# EAGLE design maho-encoder (EAGLE 4.16)
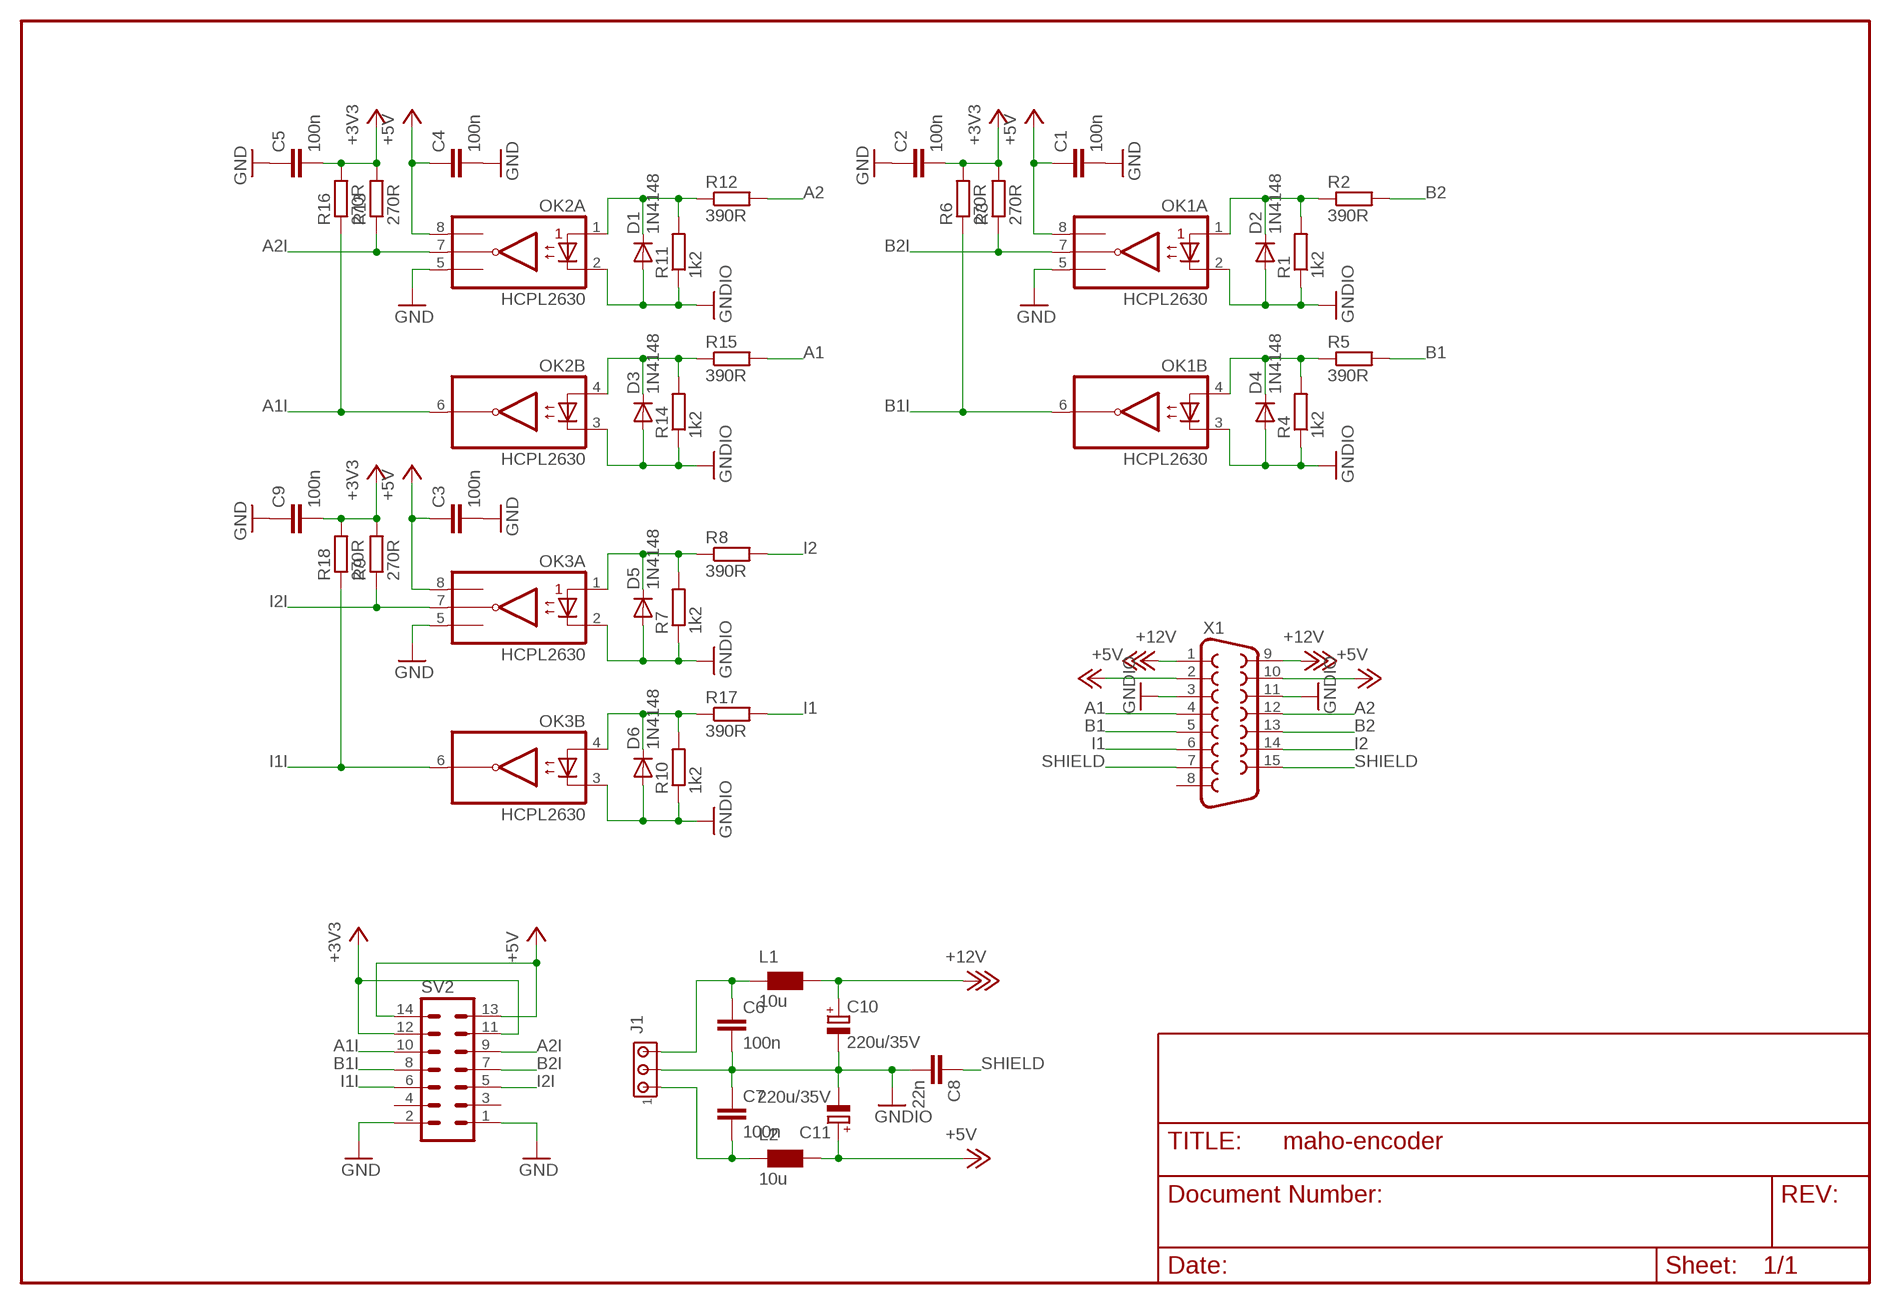
[diagram p0: schematic, sheet 1]

## Parts
C1  100n  C-EUC0603  [C0603]
C2  100n  C-EUC0603  [C0603]
C3  100n  C-EUC0603  [C0603]
C4  100n  C-EUC0603  [C0603]
C5  100n  C-EUC0603  [C0603]
C6  100n  C-EUC0603  [C0603]
C7  100n  C-EUC0603  [C0603]
C8  22n  C-EUC0603  [C0603]
C9  100n  C-EUC0603  [C0603]
C10  220u/35V  CPOL-EUF  [PANASONIC_F]
C11  220u/35V  CPOL-EUF  [PANASONIC_F]
D1  1N4148  DIODE-MINIMELF  [MINIMELF]
D2  1N4148  DIODE-MINIMELF  [MINIMELF]
D3  1N4148  DIODE-MINIMELF  [MINIMELF]
D4  1N4148  DIODE-MINIMELF  [MINIMELF]
D5  1N4148  DIODE-MINIMELF  [MINIMELF]
D6  1N4148  DIODE-MINIMELF  [MINIMELF]
J1  MTA03-100  [10X03MTA]
L1  10u  WE-HC_744312...  [WE-HC_744312...]
L2  10u  WE-HC_744312...  [WE-HC_744312...]
OK1  HCPL2630  [DIL08]
OK2  HCPL2630  [DIL08]
OK3  HCPL2630  [DIL08]
R1  1k2  R-EU_R0805  [R0805]
R2  390R  R-EU_R0805  [R0805]
R3  270R  R-EU_R0805  [R0805]
R4  1k2  R-EU_R0805  [R0805]
R5  390R  R-EU_R0805  [R0805]
R6  270R  R-EU_R0805  [R0805]
R7  1k2  R-EU_R0805  [R0805]
R8  390R  R-EU_R0805  [R0805]
R9  270R  R-EU_R0805  [R0805]
R10  1k2  R-EU_R0805  [R0805]
R11  1k2  R-EU_R0805  [R0805]
R12  390R  R-EU_R0805  [R0805]
R13  270R  R-EU_R0805  [R0805]
R14  1k2  R-EU_R0805  [R0805]
R15  390R  R-EU_R0805  [R0805]
R16  270R  R-EU_R0805  [R0805]
R17  390R  R-EU_R0805  [R0805]
R18  270R  R-EU_R0805  [R0805]
SV2  ML14  [ML14]
X1  F15HP  [F15HP]

## Nets
+3V3: C2.2 C5.2 C9.2 R3.2 R6.2 R9.2 R13.2 R16.2 R18.2 SV2.11 SV2.12
+5V: C1.1 C3.1 C4.1 OK1.8(A:VCC) OK2.8(A:VCC) OK3.8(A:VCC) SV2.13 SV2.14
+12V: C11.+ L2.2 X1.2 X1.10 ; supply symbol labelled +5V
+18V: C10.+ L1.2 X1.1 X1.9 ; supply symbol labelled +12V
A1: R15.2 X1.4
A1I: OK2.6(B:VO2) R16.1 SV2.10
A2: R12.2 X1.12
A2I: OK2.7(A:VO1) R13.1 SV2.9
B1: R5.2 X1.5
B1I: OK1.6(B:VO2) R6.1 SV2.8
B2: R2.2 X1.13
B2I: OK1.7(A:VO1) R3.1 SV2.7
GND: C1.2 C2.1 C3.2 C4.2 C5.1 C9.1 OK1.5(A:GND) OK2.5(A:GND) OK3.5(A:GND) SV2.1 SV2.2
GNDIO: C6.2 C7.1 C8.2 C10.- C11.- D1.A D2.A D3.A D4.A D5.A D6.A J1.2 OK1.2(A:C1) OK1.3(B:C2) OK2.2(A:C1) OK2.3(B:C2) OK3.2(A:C1) OK3.3(B:C2) R1.1 R4.1 R7.1 R10.1 R11.1 R14.1 X1.3 X1.11
I1: R17.2 X1.6
I1I: OK3.6(B:VO2) R18.1 SV2.6
I2: R8.2 X1.14
I2I: OK3.7(A:VO1) R9.1 SV2.5
N$1: D3.C OK2.4(B:A2) R14.2 R15.1
N$2: D1.C OK2.1(A:A1) R11.2 R12.1
N$3: D4.C OK1.4(B:A2) R4.2 R5.1
N$4: D2.C OK1.1(A:A1) R1.2 R2.1
N$5: D6.C OK3.4(B:A2) R10.2 R17.1
N$6: D5.C OK3.1(A:A1) R7.2 R8.1
N$7: C7.2 J1.1 L2.1
N$15: C6.1 J1.3 L1.1
SHIELD: C8.1 X1.7 X1.15
Unconnected: SV2.3 SV2.4 X1.8

## Library data of the parts
C1-C9 = rcl:C-EU: CAPACITOR, European symbol
C10 C11 = rcl:CPOL-EU: POLARIZED CAPACITOR, European symbol
D1-D6 = diode:DIODE-: DIODE
J1 = con-amp:MTA03-100: AMP connector
L1 L2 = wuerth-elektronik:WE-HC: SMD-Flat Wire Inductors WE-HC HIGH CURRENT Lower losses and no thermal aging because of the new advanced core material Superflux 200 - Flat wire coil for lower losses at high frequency ranges - Low leakage field - Extremely low profile design - Current loading up to 30 A -- Graphic cards -- Laptops -- Motherboards -- High current switching regulators -- Automotive electronics
OK1-OK3 = optocoupler:HCPL2630: HEWLETT PACKARD OPTO COUPLER
R1-R18 = rcl:R-EU_: RESISTOR, European symbol
SV2 = con-harting-ml:ML14: HARTING
X1 = con-subd:F15: SUB-D

## Board
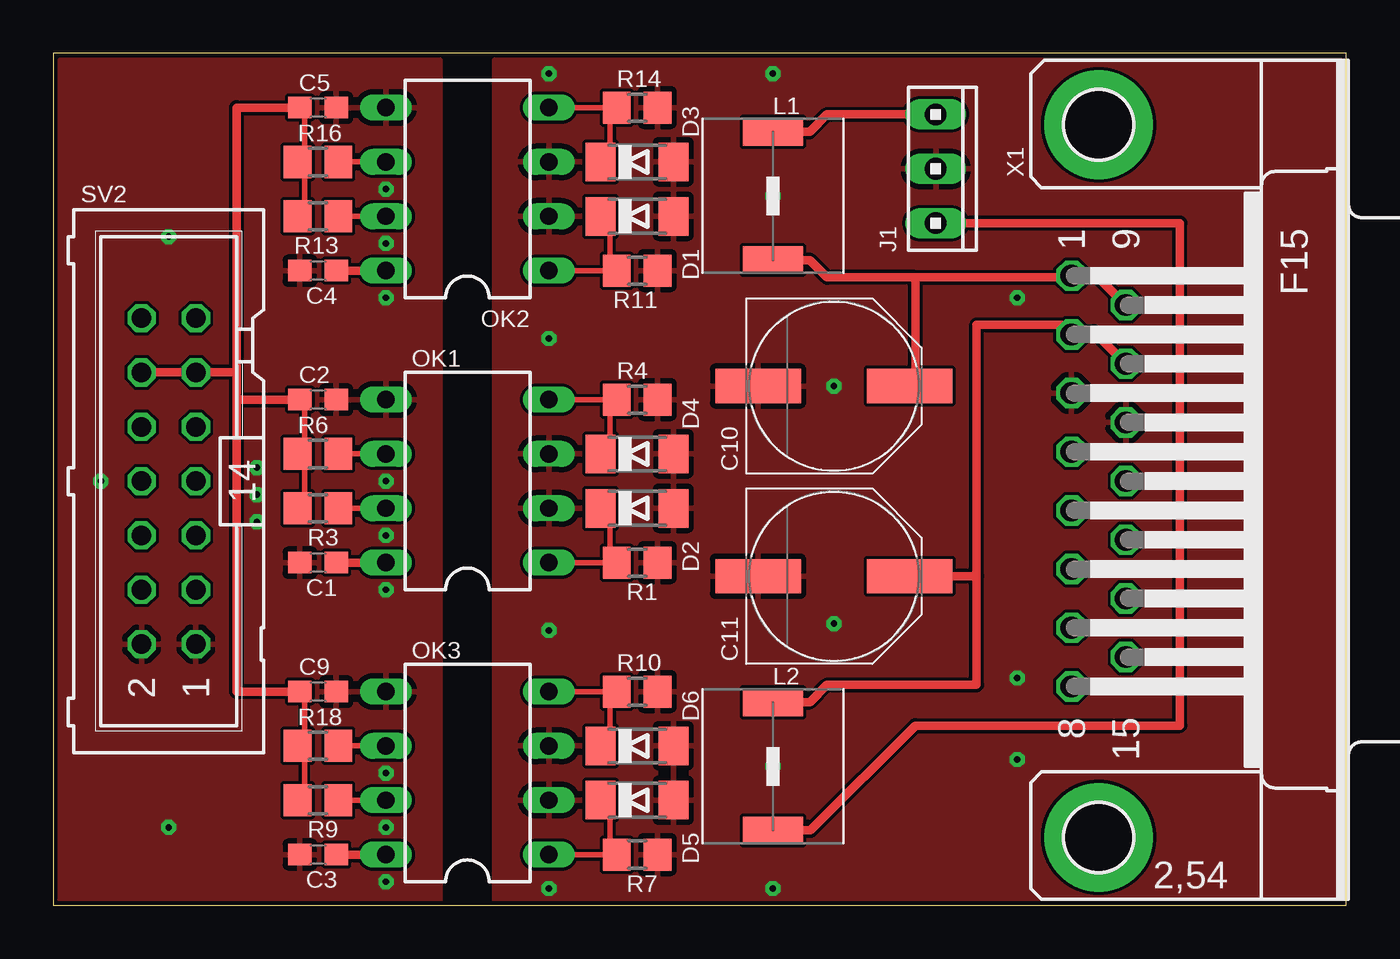
[diagram p1: board, top side]
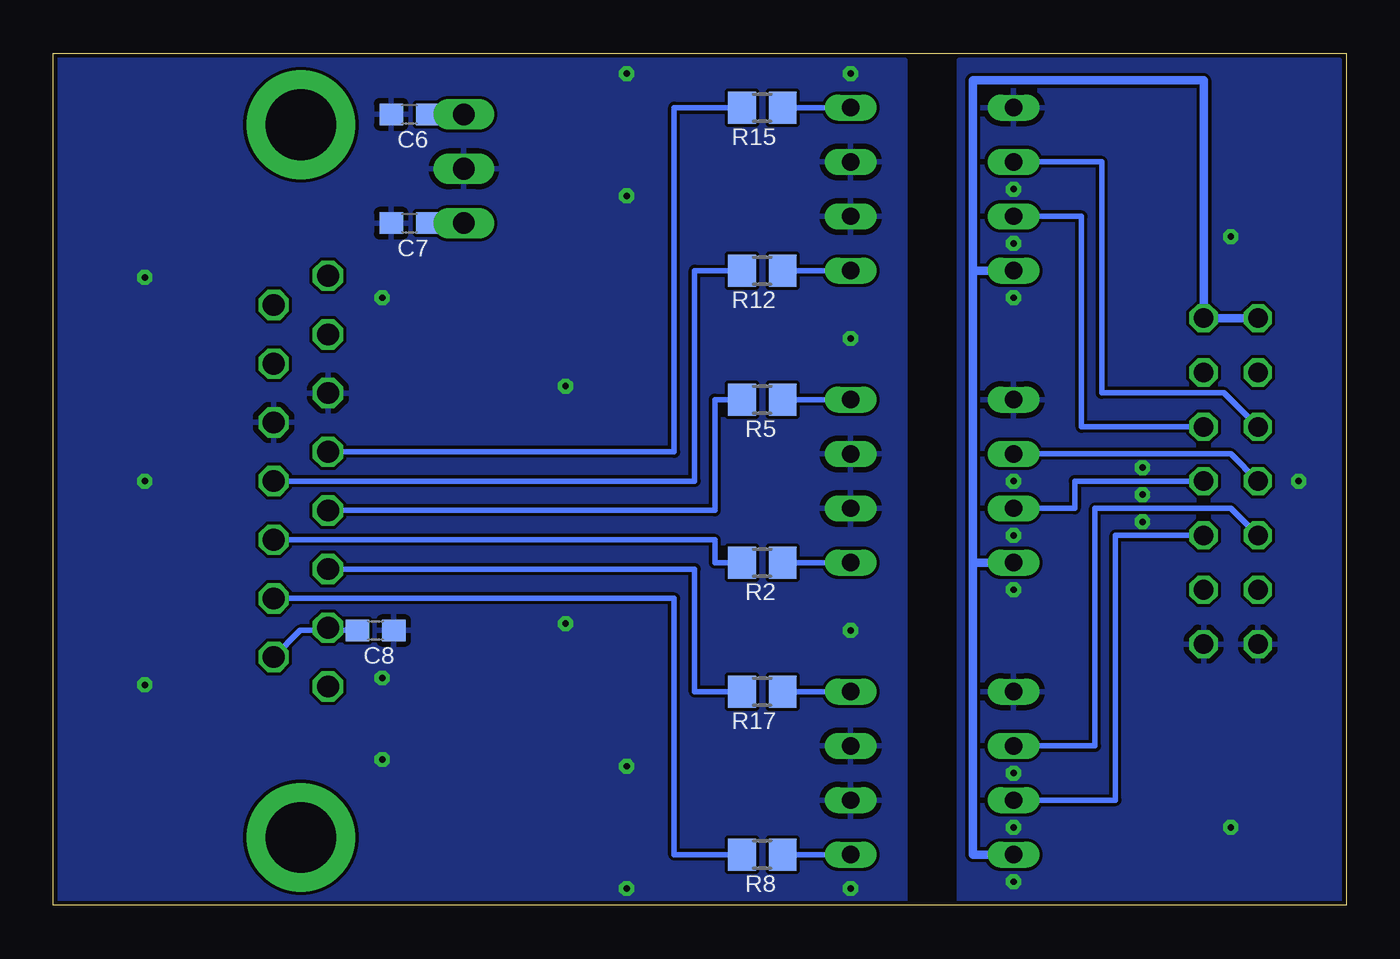
[diagram p2: board, bottom side, seen from below]

Size 60.46 x 39.83 mm. Coordinates in mm from the lower left corner, seen from the top.
Outline: 0,0 60.46,0 60.46,39.83 0,39.83 0,0
Copper layers (1+2*15+16): Top 0.035mm / dielectric 0.15mm / Route2 0.018mm / dielectric 1.5mm / Route15 0.018mm / dielectric 0.15mm / Bottom 0.035mm
Design rules "eurocircuits_class5": minimum track width 0.15mm, minimum drill 0.2mm, track to track 0.15mm, track to pad 0.15mm, pad to pad 0.15mm, via to via 0.15mm, smd to smd 0mil, copper to edge 0.2mm, drill to drill 0.2mm, minimum pad ring 0.2mm, minimum via ring 0.2mm, stop-mask expansion 4mil, vias tented up to drill 0mil, thermal gap 10mil

### Footprints (pad centres in the part's own frame; a part is rotated, then mirrored left to right if it is on the bottom)
C0603 = smd 1.1 x 1: 1 -0.85,0; 2 0.85,0
PANASONIC_F = smd 4 x 1.6: + 3.55,0; - -3.55,0
MINIMELF = smd 1.4 x 1.8: A 1.7,0; C -1.7,0
10X03MTA = drill 1.016 long: 1 2.54,0; 2 0,0; 3 -2.54,0
WE-HC_744312... = smd 1.3 x 2.8: 1 -3,0; 2 3,0
DIL08 = drill 0.813 long: 1 -3.81,-3.81; 2 -1.27,-3.81; 3 1.27,-3.81; 4 3.81,-3.81; 5 3.81,3.81; 6 1.27,3.81; 7 -1.27,3.81; 8 -3.81,3.81
R0805 = smd 1.3 x 1.5: 1 -0.95,0; 2 0.95,0
ML14 = drill 0.914 octagon: 1 -7.62,-1.27; 2 -7.62,1.27; 3 -5.08,-1.27; 4 -5.08,1.27; 5 -2.54,-1.27; 6 -2.54,1.27; 7 0,-1.27; 8 0,1.27; 9 2.54,-1.27; 10 2.54,1.27; 11 5.08,-1.27; 12 5.08,1.27; 13 7.62,-1.27; 14 7.62,1.27
F15HP = drill 1.016 octagon: 1 -9.601,-1.27; 2 -6.858,-1.27; 3 -4.115,-1.27; 4 -1.372,-1.27; 5 1.372,-1.27; 6 4.115,-1.27; 7 6.858,-1.27; 8 9.601,-1.27; 9 -8.23,1.27; 10 -5.486,1.27; 11 -2.743,1.27; 12 0,1.27; 13 2.743,1.27; 14 5.486,1.27; 15 8.23,1.27 | drill 3.302 pad 5.08 round: G1 -16.662,0; G2 16.662,0

### Placement (x,y rotation side)
C1  12.38,16.03 180 top
C2  12.38,23.65 180 top
C3  12.38,2.38 180 top
C4  12.38,29.68 180 top
C5  12.38,37.3 180 top
C6  43.81,36.98 180 bottom
C7  43.81,31.9 0 bottom
C8  45.4,12.85 0 bottom
C9  12.38,10 180 top
C10  36.51,24.28 0 top
C11  36.51,15.39 0 top
D1  27.3,32.22 0 top
D2  27.3,18.57 0 top
D3  27.3,34.76 0 top
D4  27.3,21.11 0 top
D5  27.3,4.92 0 top
D6  27.3,7.46 0 top
J1  41.27,34.44 270 top
L1  33.65,33.17 270 top
L2  33.65,6.5 90 top
OK1  19.36,19.84 90 top
OK2  19.36,33.49 90 top
OK3  19.36,6.18 90 top
R1  27.3,16.03 180 top
R2  27.3,16.03 180 bottom
R3  12.38,18.57 180 top
R4  27.3,23.65 180 top
R5  27.3,23.65 180 bottom
R6  12.38,21.11 180 top
R7  27.3,2.38 180 top
R8  27.3,2.38 180 bottom
R9  12.38,4.92 180 top
R10  27.3,10 180 top
R11  27.3,29.68 180 top
R12  27.3,29.68 180 bottom
R13  12.38,32.22 180 top
R14  27.3,37.3 180 top
R15  27.3,37.3 180 bottom
R16  12.38,34.76 180 top
R17  27.3,10 180 bottom
R18  12.38,7.46 180 top
SV2  5.39,19.84 90 top
X1  48.89,19.84 270 top

### Tracks (layer width: path | path; a pad name or v marks a point on that pad's centre or on a via)
+3V3
  Top 0.254: R9.2 11.74,4.92 11.74,7.46 | 11.74,7.46 R18.2 | C9.2 11.74,10 11.74,7.46 | R3.2 11.74,18.57 11.74,21.11 | 11.74,21.11 R6.2 | C2.2 11.74,23.65 11.74,21.11 | C5.2 11.74,37.3 11.74,34.76 | R13.2 11.74,32.22 11.74,34.76 | 11.74,34.76 R16.2
  Top 0.406: SV2.12 SV2.11 8.57,24.92 | 8.57,23.65 8.57,24.92 | 8.57,23.65 C2.2 | 8.57,24.92 8.57,37.3 C5.2 | C9.2 8.57,10 8.57,23.65
+5V
  Top 0.406: C3.1 OK3.8 | OK1.8 C1.1 | OK2.8 C4.1
  Bottom 0.406: SV2.14 SV2.13 6.66,38.57 17.46,38.57 17.46,29.68 | 17.46,29.68 OK2.8 | 17.46,16.03 OK1.8 | 17.46,16.03 17.46,29.68 | OK3.8 17.46,2.38 17.46,16.03
+12V
  Top 0.406: L2.2 35.38,9.5 36.19,10.31 43.18,10.31 43.18,15.39 | X1.10 48.66,26.82 47.62,26.82 X1.2 47.18,27.14 43.18,27.14 43.18,15.39 | 43.18,15.39 C11.+
+18V
  Top 0.406: X1.9 48.87,29.36 47.62,29.36 X1.1 47.54,29.36 40.32,29.36 | C10.+ 40.32,24.28 40.32,29.36 | L1.2 35.38,30.17 36.19,29.36 40.32,29.36
A1
  Bottom 0.254: X1.4 31.43,21.21 31.43,37.3 R15.2
A1I
  Top 0.254: OK2.6 R16.1
  Bottom 0.254: SV2.10 5.71,23.96 11.43,23.96 11.43,34.76 OK2.6
A2
  Bottom 0.254: X1.12 30.47,19.84 30.47,29.68 R12.2
A2I
  Top 0.254: OK2.7 R13.1
  Bottom 0.254: SV2.9 12.38,22.38 12.38,32.22 OK2.7
B1
  Bottom 0.254: X1.5 29.52,18.47 29.52,23.65 R5.2
B1I
  Top 0.254: OK1.6 R6.1
  Bottom 0.254: SV2.8 5.39,21.11 OK1.6
B2
  Bottom 0.254: X1.13 29.52,17.09 29.52,16.03 R2.2
B2I
  Top 0.254: OK1.7 R3.1
  Bottom 0.254: SV2.7 12.7,19.84 12.7,18.57 OK1.7
GND  (via drill 0.3)
  other vias: 15.55,33.49 15.55,30.95 15.55,28.41 15.55,19.84 15.55,17.3 15.55,14.76 15.55,6.18 15.55,3.64 15.55,1.1 5.39,3.64 9.52,20.47 9.52,19.2 9.52,17.93 2.22,19.84 5.39,31.27
  pour Top: 0.31,39.52 18.09,39.52 18.09,0.15 0.31,0.15
  pour Bottom: 0.31,39.52 18.09,39.52 18.09,0.15 0.31,0.15
GNDIO  (via drill 0.3)
  other vias: 36.51,24.28 36.51,13.17 33.65,6.5 33.65,33.17 23.17,26.5 23.17,12.85 23.17,0.79 23.17,38.89 33.65,38.89 45.08,28.41 45.08,10.63 56.19,19.84 56.19,29.36 56.19,10.31 45.08,6.82 33.65,0.79
  pour Top: 60.32,0.15 20.63,0.15 20.63,39.52 60.32,39.52
  pour Bottom: 60.32,0.15 20.63,0.15 20.63,39.52 60.32,39.52
I1
  Bottom 0.254: X1.6 30.47,15.72 30.47,10 R17.2
I1I
  Top 0.254: R18.1 OK3.6
  Bottom 0.254: SV2.6 5.39,18.57 11.74,18.57 11.74,7.46 OK3.6
I2
  Bottom 0.254: X1.14 31.43,14.35 31.43,2.38 R8.2
I2I
  Top 0.254: R9.1 OK3.7
  Bottom 0.254: SV2.5 10.79,17.3 10.79,4.92 OK3.7
N$1
  Top 0.254: OK2.4 26.03,37.3 | 26.03,37.3 R15.1 | D3.C 26.03,34.76 26.03,37.3
  Bottom 0.254: OK2.4 R15.1
N$2
  Top 0.254: OK2.1 26.03,29.68 | 26.03,29.68 R12.1 | D1.C 26.03,32.22 26.03,29.68
  Bottom 0.254: OK2.1 R12.1
N$3
  Top 0.254: OK1.4 26.03,23.65 | 26.03,23.65 R5.1 | D4.C 26.03,21.11 26.03,23.65
  Bottom 0.254: OK1.4 R5.1
N$4
  Top 0.254: OK1.1 26.03,16.03 | 26.03,16.03 R2.1 | D2.C 26.03,18.57 26.03,16.03
  Bottom 0.254: OK1.1 R2.1
N$5
  Top 0.254: OK3.4 26.03,10 | 26.03,10 R17.1 | D6.C 26.03,7.46 26.03,10
  Bottom 0.254: OK3.4 R17.1
N$6
  Top 0.254: OK3.1 26.03,2.38 | 26.03,2.38 R8.1 | D5.C 26.03,4.92 26.03,2.38
  Bottom 0.254: OK3.1 R8.1
N$7
  Top 0.406: L2.1 35.41,3.5 40.32,8.41 52.7,8.41 52.7,31.9 J1.1
  Bottom 0.406: J1.1 C7.2
N$15
  Top 0.406: L1.1 35.38,36.17 36.19,36.98 J1.3
  Bottom 0.406: J1.3 C6.1
SHIELD
  Bottom 0.254: C8.1 47.62,12.85 | 47.62,12.85 X1.7 | X1.15 48.91,12.85 47.62,12.85